# Altium schematic sheet TC4056.schdoc
size 57 x 40 mm
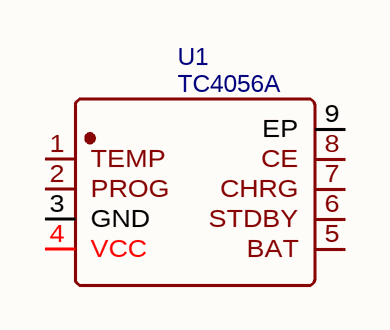
[diagram p0: TC4056.schdoc]

## Parts
U1  TC4056A  [SOP-8_L4.9-W3.9-P1.27-LS6.0-BL-EP]

## Nets

Not connected (* = marked no-connect by the designer): U1 1(TEMP) 2(PROG) 3(GND) 4(VCC) 5(BAT) 6(STDBY) 7(CHRG) 8(CE) 9(EP)

## Library data of the parts
U1 = TC4056A: BOM_Manufacturer: FM; SMT Type: Extend; BOM_Supplier: LCSC; BOM_Manufacturer Part: TC4056A; BOM_Supplier Part: C84051; BOM_LCSC Assembly: Yes; spicePre: U; spiceSymbolName: TC4056A